# EAGLE design LooRollSensorMiddleBoard (EAGLE 7.4.0)
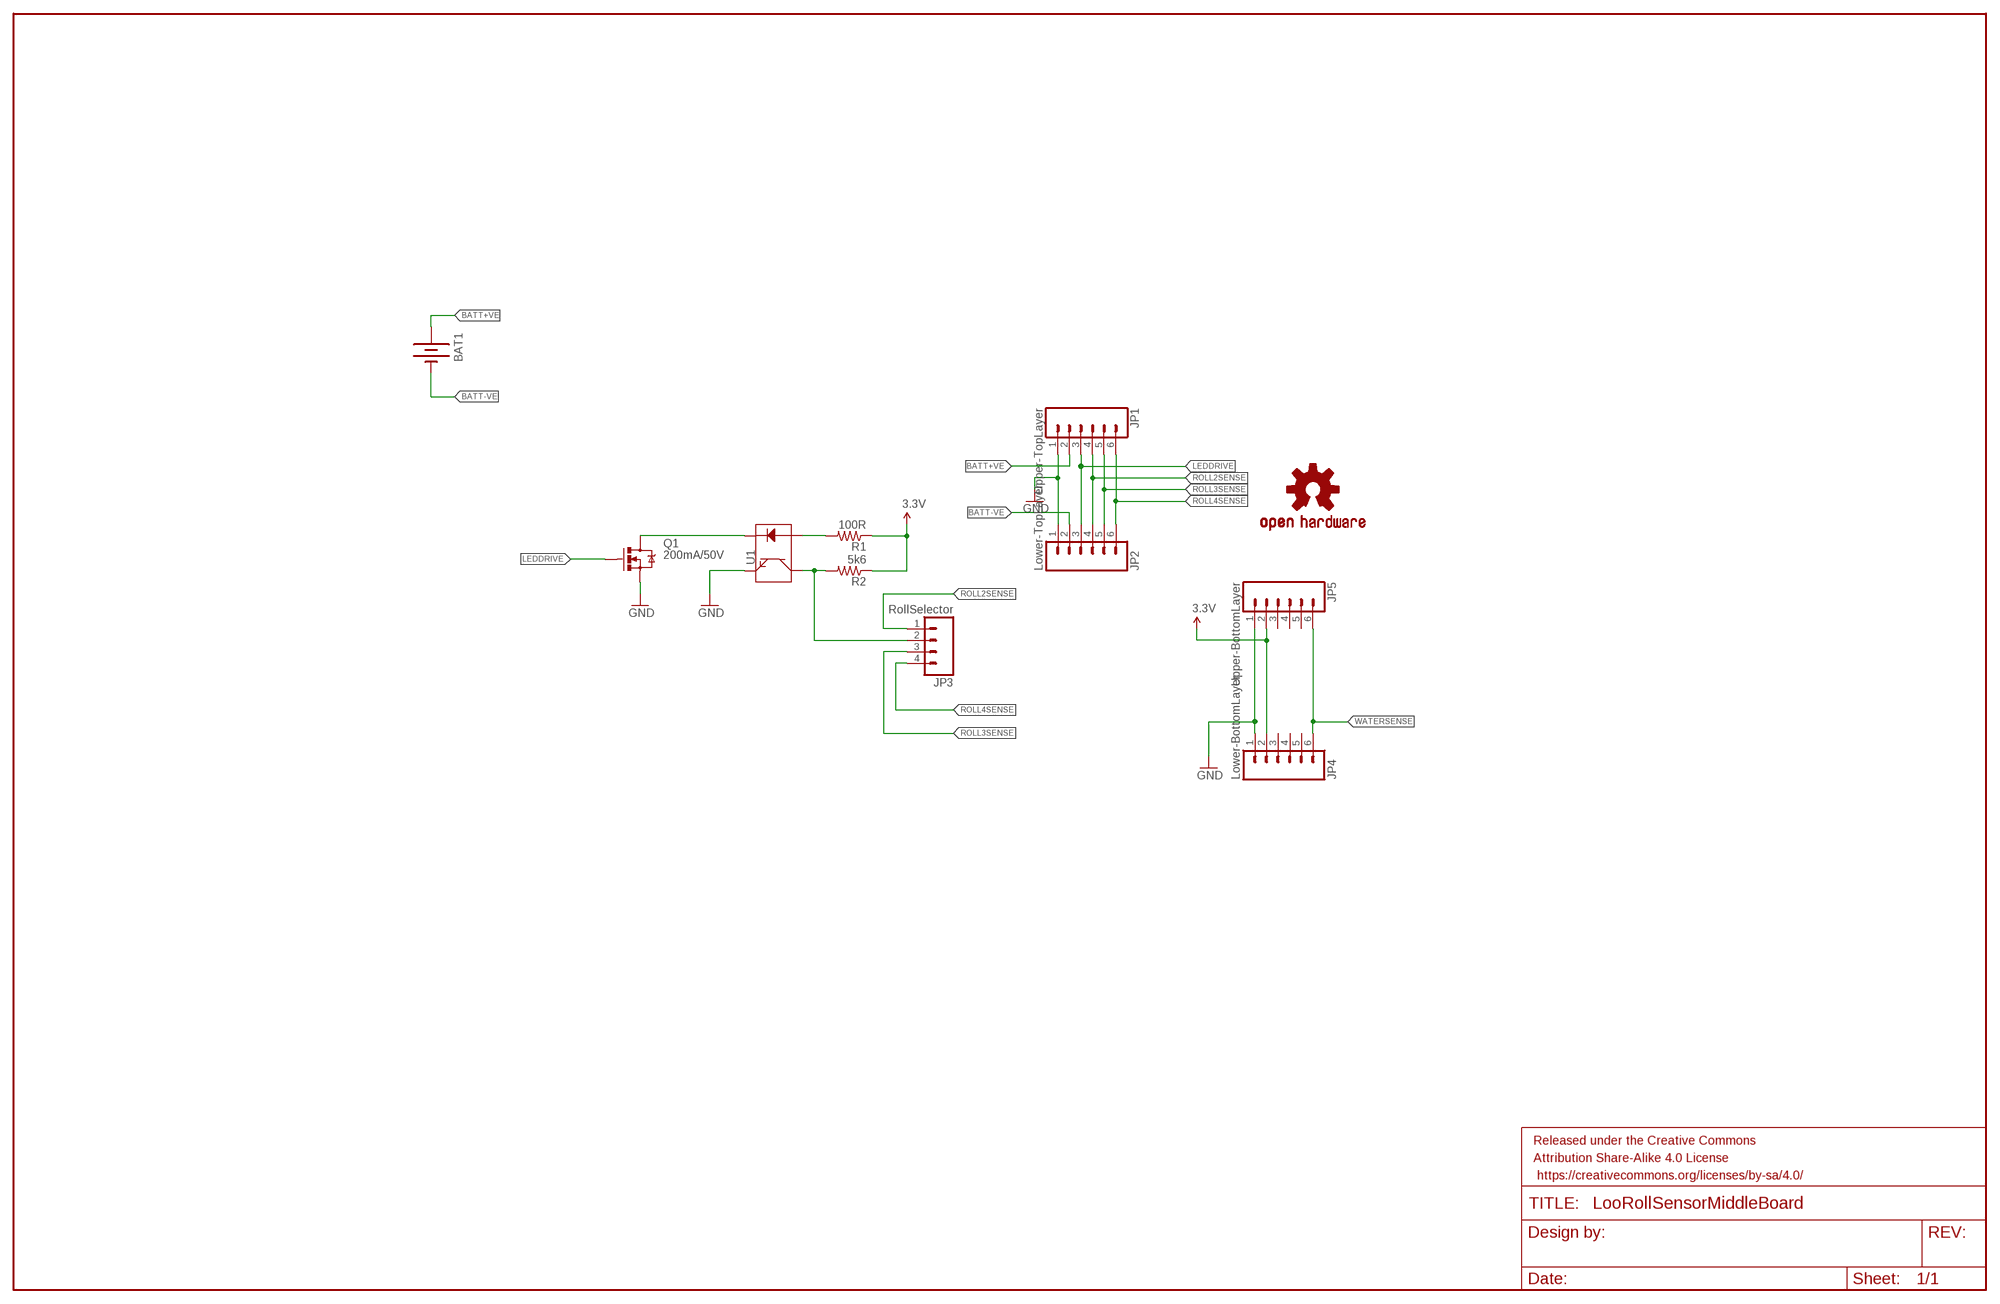
[diagram p0: schematic, sheet 1]

## Parts
BAT1  BATTERYAA-PANEL  [BATTERY-AA-PANEL]
FRAME1  FRAME-LEDGER  [CREATIVE_COMMONS]
JP1  Upper-TopLayer  M061X06-SMD-EDGE-SOLDERLINK1X06-SMD-EDGE-SOLDERLINK  [1X06-SMD_EDGE]
JP2  Lower-TopLayer  M061X06-SMD-EDGE-SOLDERLINK1X06-SMD-EDGE-SOLDERLINK  [1X06-SMD_EDGE]
JP3  RollSelector  M04PTH  [1X04]
JP4  Lower-BottomLayer  M061X06-SMD-EDGE-SOLDERLINK1X06-SMD-EDGE-SOLDERLINK  [1X06-SMD_EDGE]
JP5  Upper-BottomLayer  M061X06-SMD-EDGE-SOLDERLINK1X06-SMD-EDGE-SOLDERLINK  [1X06-SMD_EDGE]
LOGO1  OSHW-LOGOL  [OSHW-LOGO-L]
Q1  200mA/50V  MOSFET-NCHANNELBSS138  [SOT23-3]
R1  100R  RESISTOR1206  [1206]
R2  5k6  RESISTOR1206  [1206]
U1  QRE1113SMD-W  [QRE1113-W]

## Nets
3.3V: JP4.2 JP5.2 R1.1 R2.1
BATT+VE: BAT1.+ JP1.2
BATT-VE: BAT1.- JP2.2
GND: JP1.1 JP2.1 JP4.1 JP5.1 Q1.2(S) U1.4(E)
LEDDRIVE: JP1.3 JP2.3 Q1.1(G)
N$1: Q1.3(D) U1.2(K)
N$3: R1.2 U1.1(A)
ROLL2SENSE: JP1.4 JP2.4 JP3.1
ROLL3SENSE: JP1.5 JP2.5 JP3.3
ROLL4SENSE: JP1.6 JP2.6 JP3.4
ROLL_SENSE: JP3.2 R2.2 U1.3(C)
WATERSENSE: JP4.6 JP5.6
Unconnected: JP4.3 JP4.4 JP4.5 JP5.3 JP5.4 JP5.5

## Library data of the parts
BAT1 = SparkFun-Electromechanical:BATTERY: Battery Holders Various common sizes : AA, AAA, 18650 (PRT-12895), 20mm coin cell and 12mm coin cell. 20MM_4LEGS, BATT-10373
FRAME1 = SparkFun-Aesthetics:FRAME-LEDGER: Schematic Frame Standard 11x14 US Ledger frame
JP1 JP2 JP4 JP5 = Tinamous:M06: Header 6 Standard 6-pin 0.1" header. Use with straight break away headers (SKU : PRT-00116), right angle break away headers (PRT-00553), swiss pins (PRT-00743), machine pins (PRT-00117), and female headers (PRT-00115). Molex polarized connector foot print use with SKU : PRT-08094 with associated crimp pins and housings. NOTES ON THE VARIANTS LOCK and LOCK_LONGPADS... This footprint was designed to help hold the alignment of a through-hole component (i.e. 6-pin header) while soldering it into place. You may notice that each hole has been shifted either up or down by 0.005 of an inch from it's more standard position (which is a perfectly straight line). This slight alteration caused the pins (the squares in the middle) to touch the edges of the holes. Because they are alternating, it causes a "brace" to hold the component in place. 0.005 has proven to be the perfect amount of "off-center" position when using our standard breakaway headers. Although looks a little odd when you look at the bare footprint, once you have a header in there, the alteration is very hard to notice. Also,if you push a header all the way into place, it is covered up entirely on the bottom side. This idea of altering the position of holes to aid alignment will be further integrated into the Sparkfun Library for other footprints. It can help hold any component with 3 or more connection pins.
JP3 = SparkFun-Connectors:M04: Header 4 Standard 4-pin 0.1" header. Use with straight break away headers (SKU : PRT-00116), right angle break away headers (PRT-00553), swiss pins (PRT-00743), machine pins (PRT-00117), and female headers (PRT-00115). Molex polarized connector foot print use with SKU : PRT-08231 with associated crimp pins and housings. 1MM SMD Version SKU: PRT-10208; PROD_ID: CONN-09696
LOGO1 = Particle:OSHW-LOGO: Open Source Hardware Logo This logo indicates the piece of hardware it is found on incorporates a OSHW license and/or adheres to the definition of open source hardware found here: http://freedomdefined.org/OSHW
Q1 = SparkFun-DiscreteSemi:MOSFET-NCHANNEL: Common NMOSFET Parts MFG P/N Store ID Prod ID FDD8780 TRANS-09984 SI7820DN TRANS-11055 FDS6630A IC-08089 2N7002PW TRANS-11151 FQP30N06L COM-10213 TRANS-10060 BSS123LT1G TRANS-08345 BSS138 TRANS-00830 BS170 2N7000; PROD_ID: TRANS-00830
R1 R2 = SparkFun-Resistors:RESISTOR: Resistor Basic schematic elements and footprints for 0603, 1206, and PTH resistors.
U1 = SparkFun-Sensors:QRE1113: Reflective object sensor

## Board
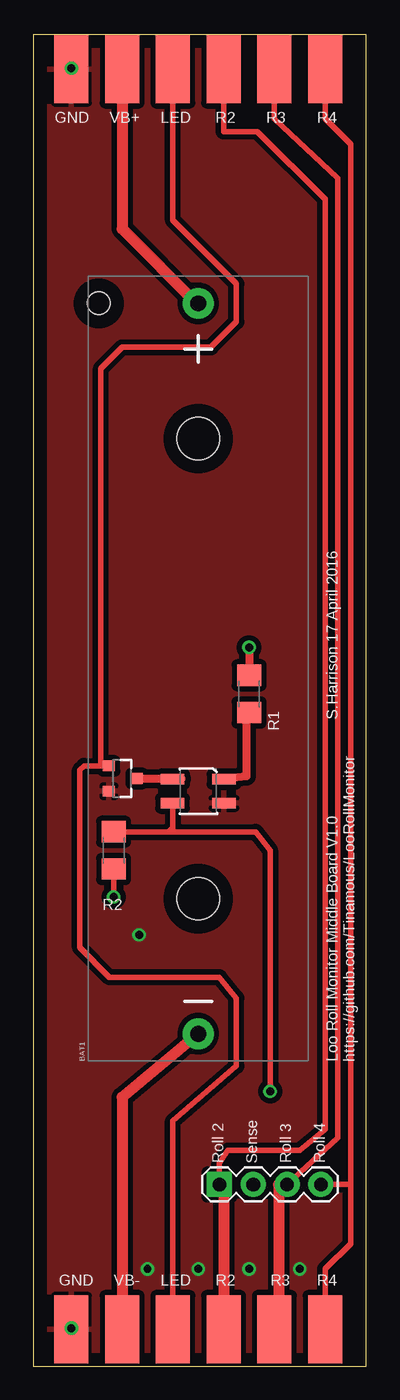
[diagram p1: board, top side]
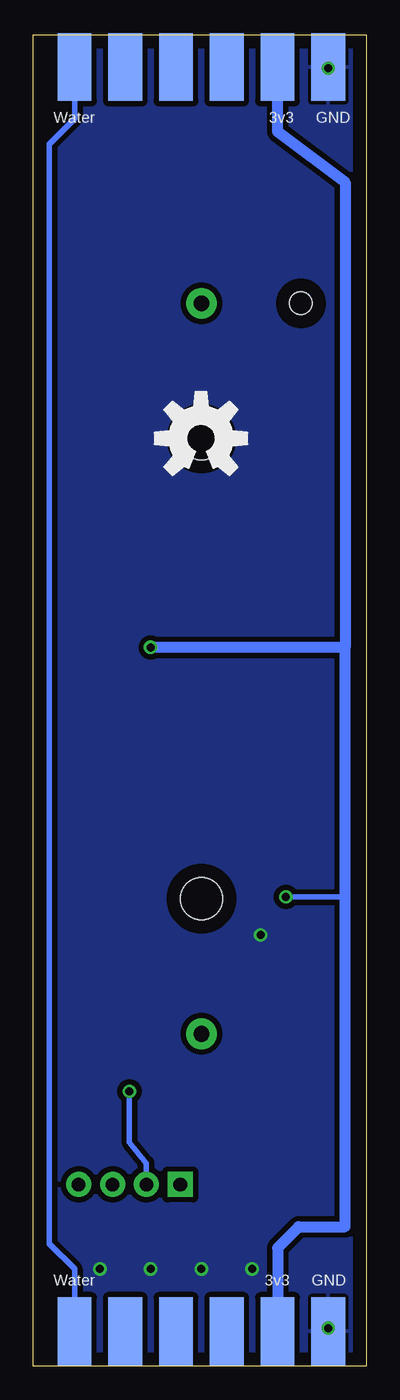
[diagram p2: board, bottom side, seen from below]

Size 25 x 100 mm. Coordinates in mm from the lower left corner, seen from the top.
Outline: 0,0 25,0 25,100 0,100 0,0
Copper layers (1*16): Top 0.035mm / dielectric 1.5mm / Bottom 0.035mm
Design rules "default": minimum track width 10mil, minimum drill 24mil, track to track 8mil, track to pad 8mil, pad to pad 8mil, via to via 8mil, smd to smd 8mil, copper to edge 40mil, drill to drill 8mil, minimum pad ring 10mil, minimum via ring 8mil, stop-mask expansion 4mil, vias tented up to drill 0mil, thermal gap 10mil

### Footprints (pad centres in the part's own frame; a part is rotated, then mirrored left to right if it is on the bottom)
BATTERY-AA-PANEL = drill 1.17 pad 2.3: + 27.43,0; - -27.43,0 | hole 3.18: 17.27,0; -17.27,0 | hole 1.7: 27.43,7.47
1X06-SMD_EDGE = smd 2.54 x 5.08: 1 0,-0.08; 2 3.81,-0.08; 3 7.62,-0.08; 4 11.43,-0.08; 5 15.24,-0.08; 6 19.05,-0.08
1X04 = drill 1.016 pad 1.88 square: 1 0,0 | drill 1.016 pad 1.88: 2 2.54,0; 3 5.08,0; 4 7.62,0
SOT23-3 = smd 0.8 x 0.9: 1 -0.95,-1; 2 0.95,-1; 3 0,1.1
1206 = smd 1.6 x 1.8: 1 -1.4,0; 2 1.4,0
QRE1113-W = smd 1.778 x 0.762: 1 -1.927,-0.9; 2 1.927,-0.9; 3 1.927,0.9; 4 -1.927,0.9

### Placement (x,y rotation side)
BAT1  12.38,52.39 90 top
FRAME1  33.97,19.68 90 top  (outside the outline)
JP1  2.86,97.47 0 top
JP2  2.86,2.86 0 top
JP3  13.97,13.65 0 top
JP4  2.86,2.54 180 bottom
JP5  2.86,97.47 180 bottom
LOGO1  12.41,69.67 0 bottom
Q1  6.67,44.13 270 top
R1  16.19,50.48 270 top
R2  6.03,38.73 90 top
U1  12.38,43.18 180 top

### Tracks (layer width: path | path; a pad name or v marks a point on that pad's centre or on a via)
3.3V  (via drill 0.6)
  Top 0.406: R2.1 v6.03,35.24
  Top 0.61: v16.19,53.98 R1.1
  Bottom 0.406: v6.03,35.24 1.59,35.24
  Bottom 0.813: 1.59,53.98 1.59,88.9 6.67,92.71 JP5.2 | 1.59,53.98 v16.19,53.98 | 1.59,53.98 1.59,35.24 1.59,10.48 5.08,10.48 6.67,8.89 JP4.2
BATT+VE
  Top 0.813: JP1.2 6.67,85.41 12.38,79.69 12.19,80.01 BAT1.+
BATT-VE
  Top 0.813: JP2.2 6.67,20.2 BAT1.-
GND  (via drill 0.6)
  other vias: 7.94,32.38 2.86,2.86 16.19,7.3 20,7.3 2.86,97.47 12.38,7.3 8.57,7.3
  pour Bottom (isolate 0.406, rank 6): -0.39,100.28 25.42,100.28 25.42,-0.52 -0.39,-0.52
  pour Top (isolate 0.406, rank 6): -0.5,100.39 25.08,100.28 24.77,0 0,0
LEDDRIVE
  Top 0.406: 5.08,45.35 5.08,45.09 3.81,45.09 3.49,44.77 3.49,31.43 5.71,29.21 13.97,29.21 15.24,27.62 15.24,22.54 10.48,18.41 JP2.3 | 5.08,45.35 Q1.1 | 5.08,45.35 5.08,74.93 6.67,76.52 13.34,76.52 15.24,78.42 15.24,81.28 10.48,86.04 JP1.3
N$1
  Top 0.406: U1.2 10.74,44.08 10.79,44.13
  Top 0.61: Q1.3 10.79,44.13 11.14,44.13
N$3
  Top 0.61: U1.1 15.99,44.3 15.99,48.19 R1.2
ROLL2SENSE
  Top 0.406: JP3.1 13.97,15.24 14.61,16.19 20,16.19 21.91,17.78 21.91,87.63 16.83,92.71 14.29,92.71 JP1.4
  Top 0.813: JP3.1 14.29,13.65 JP2.4
ROLL3SENSE
  Top 0.406: 18.1,99.06 JP1.5 18.1,93.66 22.86,89.22 22.86,17.14 JP3.3
  Top 0.813: JP3.3 18.41,13.65 18.41,3.49 18.1,3.49 JP2.5
ROLL4SENSE
  Top 0.406: JP2.6 21.91,7.3 23.81,9.21 23.81,13.65 | 23.81,13.65 23.81,91.76 21.91,93.66 JP1.6 | JP3.4 23.81,13.65
ROLL_SENSE  (via drill 0.6)
  Top 0.406: R2.2 10.16,40.13 | 10.16,40.13 16.7,40.13 17.78,38.73 v17.78,20.64 | U1.3 10.46,40.43 10.16,40.13
  Bottom 0.406: v17.78,20.64 17.78,16.83 16.51,15.24 JP3.2
WATERSENSE
  Bottom 0.406: JP5.6 21.91,93.66 23.81,91.76 23.81,9.21 21.91,7.3 JP4.6

### Text on the board
tNames: GND | VB+ | LED | R2 | R3 | R4 | S.Harrison 17 April 2016 | Loo Roll Monitor Middle Board V1.0 | https://github.com/Tinamous/LooRollMonitor | Roll 2 | Sense | Roll 3 | Roll 4 | GND | VB- | LED | R2 | R3 | R4
bNames: GND | 3v3 | Water | GND | 3v3 | Water
Measures: Loo Roll height 103mm | Max internal diameter of tube: 25mm (25.8)
Document: 1 of n middle boards.